# EAGLE schematic main (EAGLE 7.2.0)
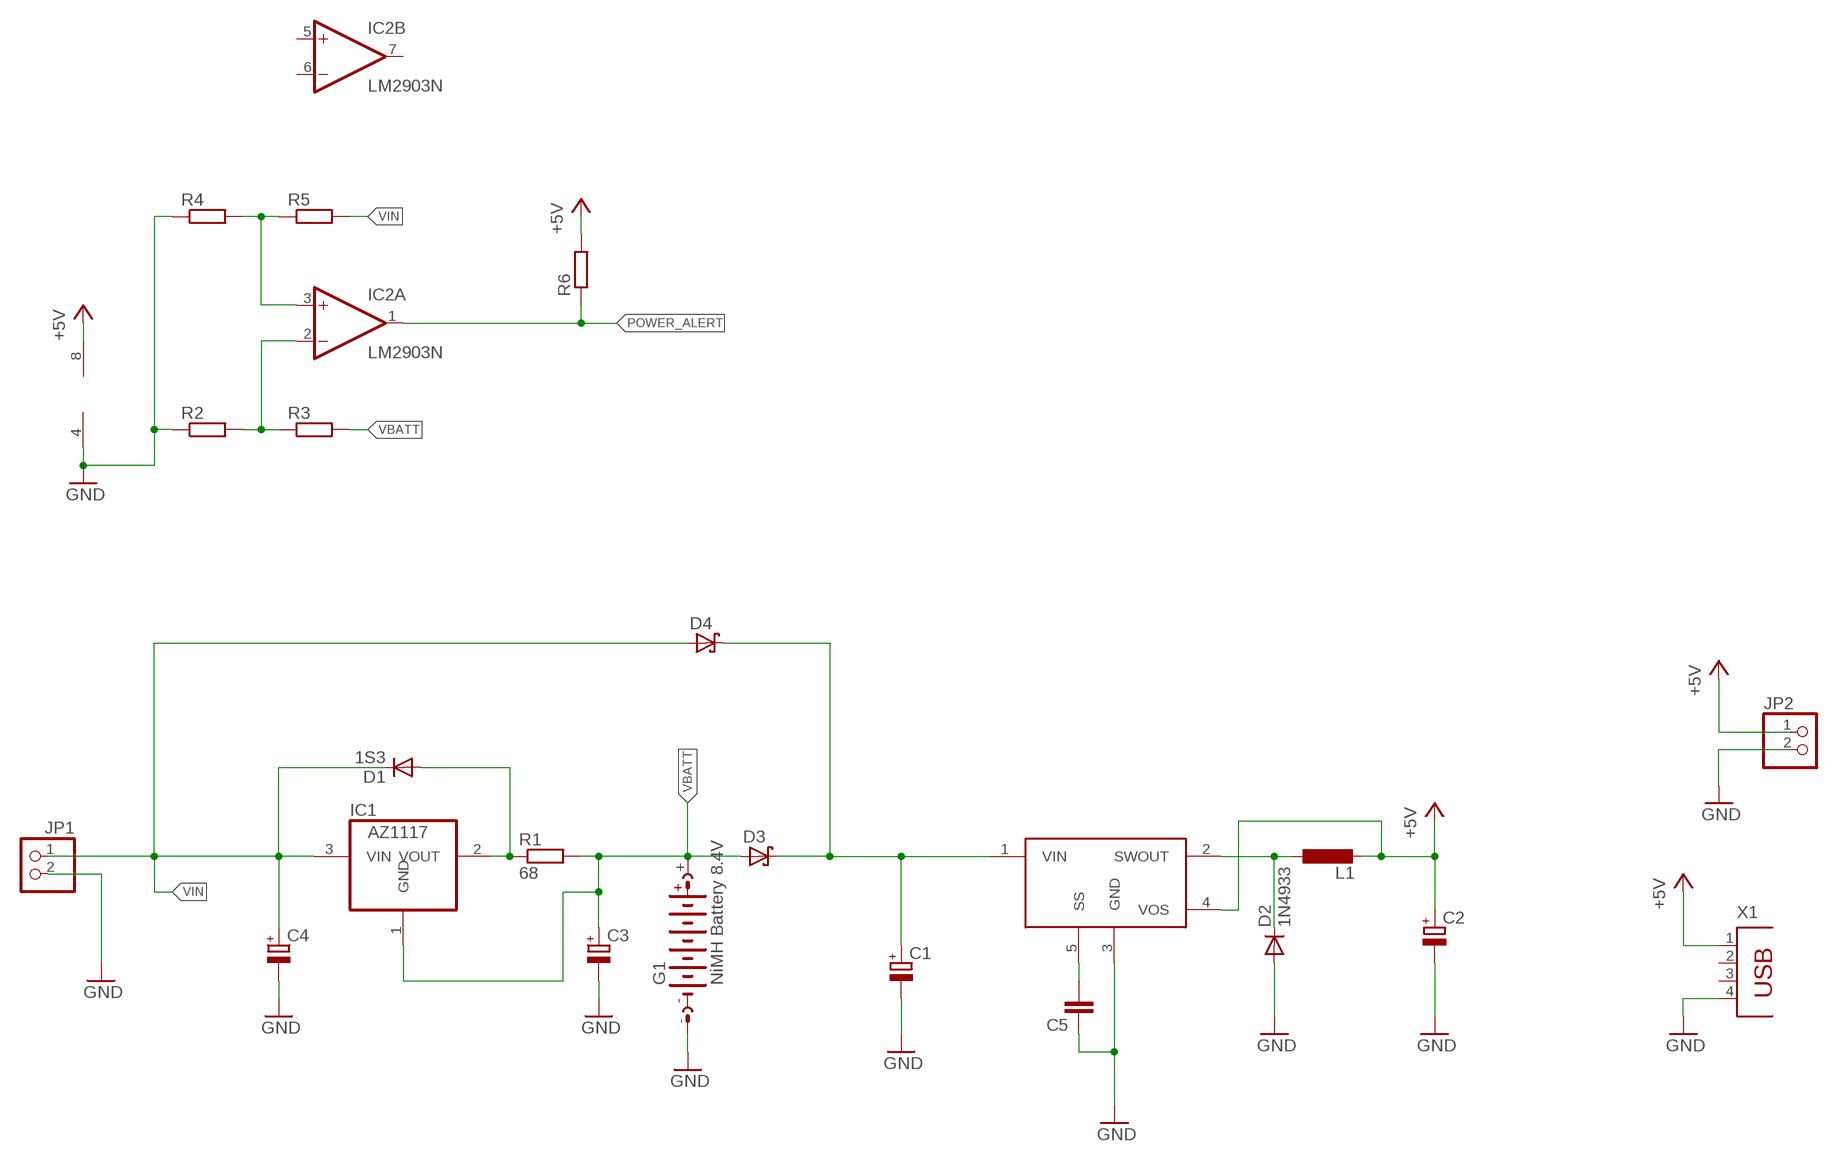
[diagram p0: schematic, sheet 1]

## Parts
C1  CPOL-EUE5-10.5  [E5-10,5]
C2  CPOL-EUE5-10.5  [E5-10,5]
C3  CPOL-EUE5-10.5  [E5-10,5]
C4  CPOL-EUE5-10.5  [E5-10,5]
C5  C-EUC0603K  [C0603K]
D1  1S3  1N4004  [DO41-10]
D2  1N4933  [DO41-10]
D3  SCHOTTKY-DIODEC4111-15  [C4111-15]
D4  SCHOTTKY-DIODEC4111-15  [C4111-15]
G1  NiMH Battery 8.4V  AB9V  [AB9V]
IC1  AZ1117  REG1117  [SOT223]
IC2  LM2903N  [DIL08]
JP1  PINHD-1X2  [1X02]
JP2  PINHD-1X2  [1X02]
L1  L-EU0207/10  [0207/10]
R1  68  R-EU_0207/12  [0207/12]
R2  R-EU_R0603  [R0603]
R3  R-EU_R0603  [R0603]
R4  R-EU_R0603  [R0603]
R5  R-EU_R0603  [R0603]
R6  R-EU_R0603  [R0603]
U$1  SI-8050S  [TO220-5]
X1  PN87520  [PN87520]

## Nets
+5V: C2.+ IC2.8(P:V+) JP2.1 L1.2 R6.2 U$1.4(VOS) X1.1
GND: C1.- C2.- C3.- C4.- C5.1 D2.A G1.- IC2.4(P:V-) JP1.2 JP2.2 R2.1 R4.1 U$1.3(GND) X1.4
N$1: C5.2 U$1.5(SS)
N$3: IC2.2(A:-IN) R2.2 R3.1
N$4: D2.C L1.1 U$1.2(SWOUT)
N$5: C1.+ D3.C D4.C U$1.1(VIN)
N$6: D1.A IC1.2(VOUT) R1.1
N$10: IC2.3(A:+IN) R4.2 R5.1
POWER_ALERT: IC2.1(A:OUT) R6.1
VBATT: C3.+ D3.A G1.+ IC1.1(GND) R1.2 R3.2
VIN: C4.+ D1.C D4.A IC1.3(VIN) JP1.1 R5.2
Unconnected: IC2.5(B:+IN) IC2.6(B:-IN) IC2.7(B:OUT) X1.2 X1.3

## Library data of the parts
C1-C4 = resistor:CPOL-EU: POLARIZED CAPACITOR, European symbol
C5 = resistor:C-EU: CAPACITOR, European symbol
D1 = diode:1N4004: DIODE general purpose rectifier, 1 A
D2 = diode:1N4933: DIODE fast recovery rectifier, 1A
D3 D4 = diode:SCHOTTKY-DIODE: Schottky Diode
G1 = battery:AB9V: 9-V BATTERY CLIP
IC1 = burr-brown:REG1117: 800mA and 1A Low Dropout (LDO) Positive Regulator 1.8V, 2.5V, 2.85V, 3.3V, 5V, and Adj; MPN: REG1117; OC_FARNELL: 1097566; OC_NEWARK: 14P6981
IC2 = linear:LM2903: COMPARATOR
JP1 JP2 = pinhead:PINHD-1X2: PIN HEADER
L1 = resistor:L-EU: INDUCTOR, European symbol
R1-R6 = resistor:R-EU_: RESISTOR, European symbol
U$1 = con-user:SI-8050S
X1 = con-berg:PN87520: BERG USB connector; OC_FARNELL: unknown; OC_NEWARK: unknown